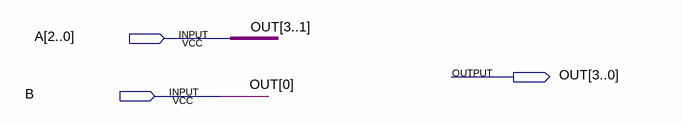
[diagram p0: schematic sheet]
// Quartus schematic Append.bdf as structural Verilog: 0 symbols, 3 pins
module Append (
  input  [2:0] A,
  input  B,
  output [3:0] OUT
);


  assign OUT = {A, B};
endmodule
